# EAGLE schematic robot2 - version pro (EAGLE 6.3)
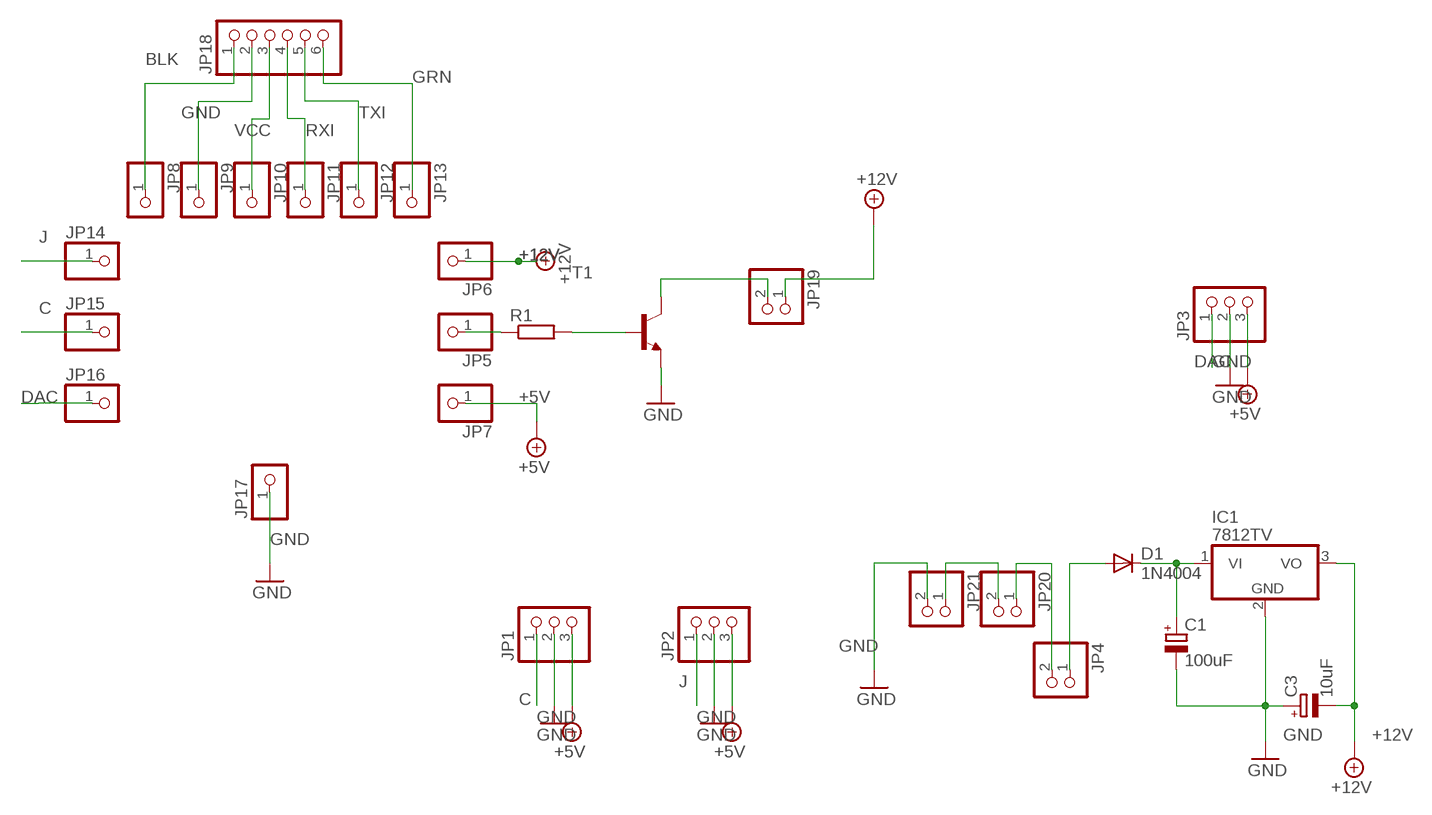
[diagram p0: schematic, sheet 1]

## Parts
C1  100uF  CPOL-EUE3.5-10  [E3,5-10]
C3  10uF  CPOL-EUE2,5-6E  [E2,5-6E]
D1  1N4004  [DO41-10]
IC1  7812TV  [TO220V]
JP1  PINHD-1X3  [1X03]
JP2  PINHD-1X3  [1X03]
JP3  PINHD-1X3  [1X03]
JP4  PINHD-1X2  [1X02]
JP5  PINHD-1X1  [1X01]
JP6  PINHD-1X1  [1X01]
JP7  PINHD-1X1  [1X01]
JP8  PINHD-1X1  [1X01]
JP9  PINHD-1X1  [1X01]
JP10  PINHD-1X1  [1X01]
JP11  PINHD-1X1  [1X01]
JP12  PINHD-1X1  [1X01]
JP13  PINHD-1X1  [1X01]
JP14  PINHD-1X1  [1X01]
JP15  PINHD-1X1  [1X01]
JP16  PINHD-1X1  [1X01]
JP17  PINHD-1X1  [1X01]
JP18  PINHD-1X6  [1X06]
JP19  PINHD-1X2  [1X02]
JP20  PINHD-1X2  [1X02]
JP21  PINHD-1X2  [1X02]
R1  R-EU_0204/7  [0204/7]
T1  2N4124-NPN-TO92-CBE  [TO92-CBE]

## Nets
+5V: JP1.3 JP2.3 JP3.3 JP7.1
+12V: C3.- IC1.3(VO) JP6.1 JP19.1
BLK: JP8.1 JP18.1
C: JP1.1 JP15.1
DAC: JP3.1 JP16.1
GND: C1.- C3.+ IC1.2(GND) JP1.2 JP2.2 JP3.2 JP9.1 JP17.1 JP18.2 JP21.2 T1.E
GRN: JP13.1 JP18.6
J: JP2.1 JP14.1
N$1: C1.+ D1.C IC1.1(VI)
N$3: D1.A JP4.1
N$4: JP4.2 JP20.1
N$6: R1.2 T1.B
N$7: JP19.2 T1.C
N$9: JP5.1 R1.1
N$10: JP20.2 JP21.1
RXI: JP11.1 JP18.4
TXI: JP12.1 JP18.5
VCC: JP10.1 JP18.3

## Library data of the parts
C1 C3 = rcl:CPOL-EU: POLARIZED CAPACITOR, European symbol
D1 = diode:1N4004: DIODE general purpose rectifier, 1 A
IC1 = linear:78*: Positive VOLTAGE REGULATOR Source: http://cache.national.com/ds/LM/LM78L05.pdf http://www.fairchildsemi.com/ds/LM/LM7805.pdf
JP1-JP3 = pinhead:PINHD-1X3: PIN HEADER
JP4 JP19-JP21 = pinhead:PINHD-1X2: PIN HEADER
JP5-JP17 = pinhead:PINHD-1X1: PIN HEADER
JP18 = pinhead:PINHD-1X6: PIN HEADER
R1 = rcl:R-EU_: RESISTOR, European symbol
T1 = transistor:*-NPN-: NPN Transistror BF959 corrected 2008.03.06